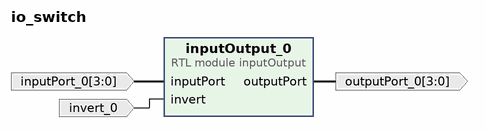
[diagram p0: block diagram of the top level]
# Vivado block design io_switch, xc7z020clg400-1, Vivado 2019.2
create_bd_design io_switch

create_bd_port -dir I -from 3 -to 0 inputPort_0
create_bd_port -dir I invert_0
create_bd_port -dir O -from 3 -to 0 outputPort_0

create_bd_cell -type module -reference inputOutput inputOutput_0

# ---- connections ----

connect_bd_net -net inputPort_0_1 [get_bd_ports inputPort_0] [get_bd_pins inputOutput_0/inputPort]
connect_bd_net -net invert_0_1 [get_bd_ports invert_0] [get_bd_pins inputOutput_0/invert]
connect_bd_net [get_bd_pins inputOutput_0/outputPort] [get_bd_ports outputPort_0]

validate_bd_design
save_bd_design
